# Altium schematic sheet MCU.SchDoc
size A4
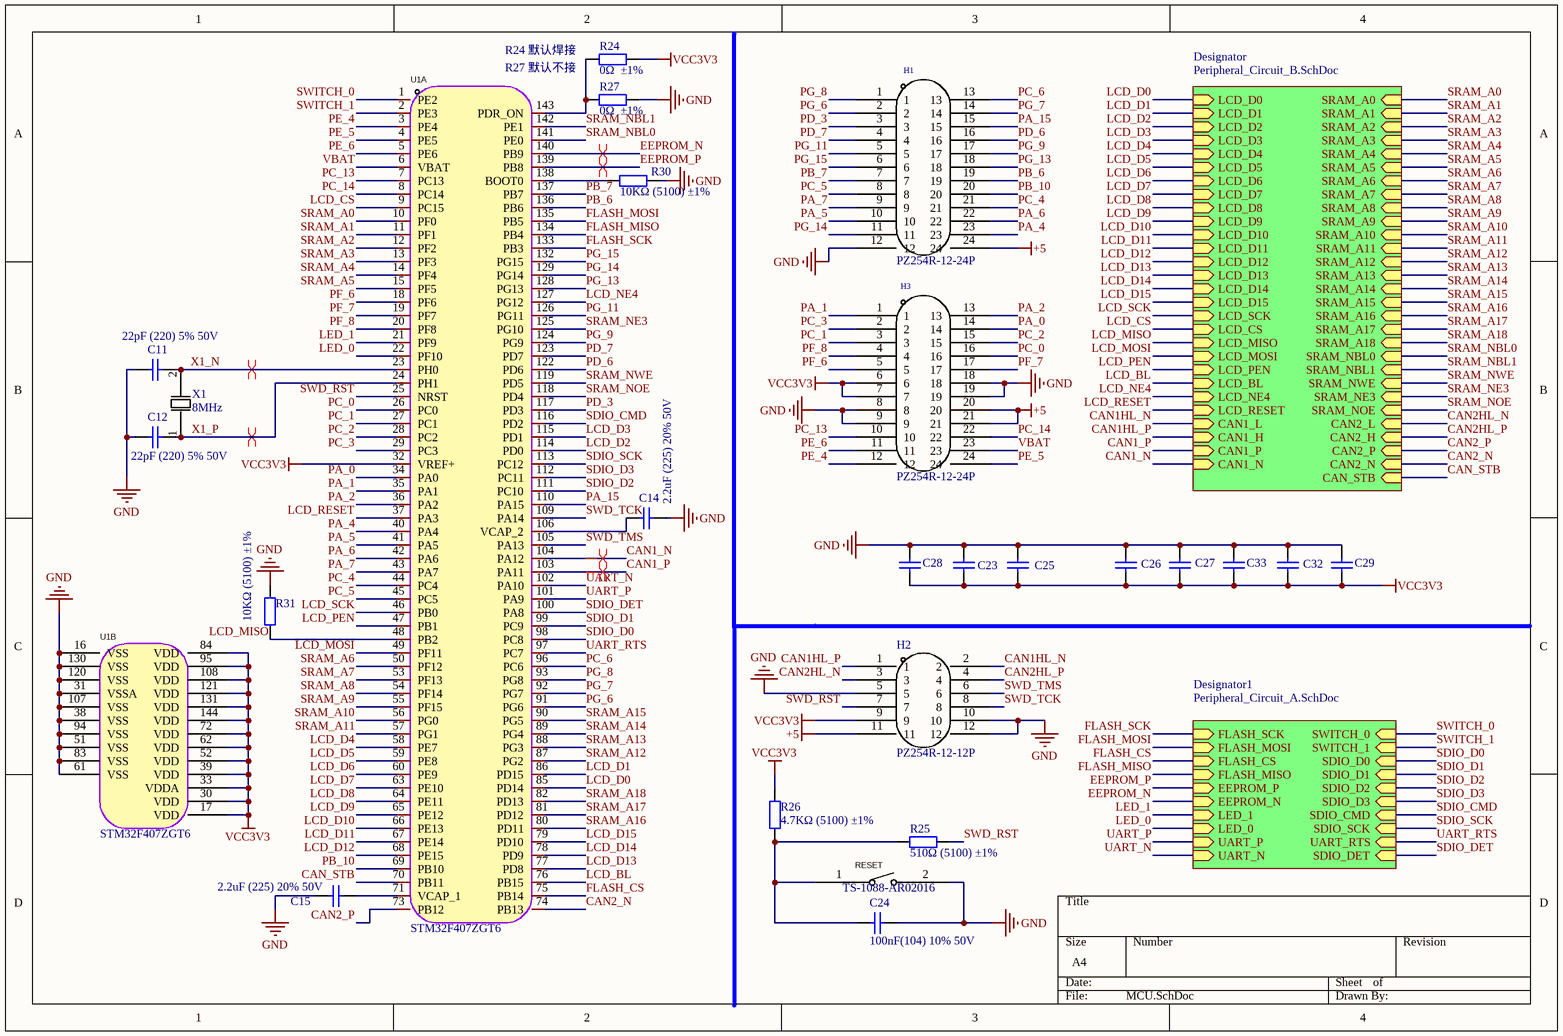
[diagram p0: MCU.SchDoc]

## Parts
C11  22pF (220) 5% 50V  [0805_C]
C12  22pF (220) 5% 50V  [0805_C]
C14  2.2uF (225) 20% 50V  [0805_C]
C15  2.2uF (225) 20% 50V  [0805_C]
C23  100nF(104) 10% 50V  [0805_C]  (value not drawn)
C24  100nF(104) 10% 50V  [0805_C]
C25  100nF(104) 10% 50V  [0805_C]  (value not drawn)
C26  100nF(104) 10% 50V  [0805_C]  (value not drawn)
C27  100nF(104) 10% 50V  [0805_C]  (value not drawn)
C28  100nF(104) 10% 50V  [0805_C]  (value not drawn)
C29  100nF(104) 10% 50V  [0805_C]  (value not drawn)
C32  100nF(104) 10% 50V  [0805_C]  (value not drawn)
C33  100nF(104) 10% 50V  [0805_C]  (value not drawn)
H1  PZ254R-12-24P  [PZ254R-12-24P]
H2  PZ254R-12-12P  [HDR-TH_12P-P2.54-H-M-R2-C6-S2.54]
H3  PZ254R-12-24P  [PZ254R-12-24P]
R24  0Ω  ±1%  [0805_R]
R25  510Ω (5100) ±1%  [0805_R]
R26  4.7KΩ (5100) ±1%  [0805_R]
R27  0Ω  ±1%  [0805_R]
R30  10KΩ (5100) ±1%  [0805_R]
R31  10KΩ (5100) ±1%  [0805_R]
RESET  TS-1088-AR02016  [SW-SMD_L3.9-W3.0-P4.45]
U1  STM32F407ZGT6  [LQFP-144_L20.0-W20.0-P0.50-LS22.0-BL]  (parts A,B of 2)
X1  8MHZ  [CRYSTAL-SMD_L5.0-W3.2]

## Sub-sheets
Designator = Peripheral_Circuit_B.SchDoc: LCD_D7 (in), LCD_D13 (in), LCD_D14 (in), LCD_D12 (in), LCD_D0 (in), LCD_SCK (in), LCD_D2 (in), LCD_D4 (in), LCD_D15 (in), LCD_NE4 (in), LCD_D3 (in), LCD_CS (in), LCD_D1 (in), LCD_RESET (in), LCD_MISO (in), LCD_MOSI (in), LCD_D10 (in), LCD_D8 (in), LCD_D6 (in), LCD_D5 (in), LCD_D9 (in), LCD_PEN (in), LCD_D11 (in), LCD_BL (in), SRAM_NWE (in), SRAM_NE3 (in), SRAM_NOE (in), SRAM_A12 (in), SRAM_A13 (in), SRAM_A16 (in), SRAM_A18 (in), SRAM_A10 (in), SRAM_A5 (in), SRAM_A17 (in), SRAM_A9 (in), SRAM_A7 (in), SRAM_A11 (in), SRAM_A15 (in), SRAM_A8 (in), SRAM_A6 (in), SRAM_A2 (in), SRAM_A14 (in), SRAM_NBL0 (in), SRAM_NBL1 (in), SRAM_A3 (in), SRAM_A0 (in), SRAM_A1 (in), SRAM_A4 (in), CAN2_L (in), CAN2_H (in), CAN2_P (in), CAN2_N (in), CAN1_N (in), CAN1_P (in), CAN1_H (in), CAN1_L (in), CAN_STB (in)
Designator1 = Peripheral_Circuit_A.SchDoc: LED_0 (in), SWITCH_1 (in), LED_1 (in), SWITCH_0 (in), SDIO_D0 (in), SDIO_SCK (in), FLASH_CS (in), SDIO_D2 (in), FLASH_SCK (in), SDIO_D3 (in), SDIO_D1 (in), SDIO_CMD (in), FLASH_MOSI (in), FLASH_MISO (in), SDIO_DET (in), EEPROM_P (in), EEPROM_N (in), UART_N (in), UART_P (in), UART_RTS (in)

## Nets
+5: H1.24 H2.11 H3.20 H3.21
GND: C11.1 C12.1 C14.2 C15.1 C23.2 C24.1 C25.2 C26.2 C27.2 C28.1 C29.1 C32.2 C33.1 H1.12 H2.5 H2.10 H2.12 H3.8 H3.9 H3.18 H3.19 R27.2 R30.1 R31.1 RESET.2 U1.16(VSS) U1.31(VSSA) U1.38(VSS) U1.51(VSS) U1.61(VSS) U1.83(VSS) U1.94(VSS) U1.107(VSS) U1.120(VSS) U1.130(VSS)
VCC3V3: C23.1 C25.1 C26.1 C27.1 C28.2 C29.2 C32.1 C33.2 H2.9 H3.6 H3.7 R24.2 R26.1 U1.17(VDD) U1.30(VDD) U1.32(VREF+) U1.33(VDDA) U1.39(VDD) U1.52(VDD) U1.62(VDD) U1.72(VDD) U1.84(VDD) U1.95(VDD) U1.108(VDD) U1.121(VDD) U1.131(VDD) U1.144(VDD)
CAN1_N: U1.104(PA12) ; sheet Designator/CAN1_N
CAN1_P: U1.103(PA11) ; sheet Designator/CAN1_P
CAN1HL_N: H2.2 ; sheet Designator/CAN1_L
CAN1HL_P: H2.1 ; sheet Designator/CAN1_H
CAN2_N: U1.74(PB13) ; sheet Designator/CAN2_N
CAN2_P: U1.73(PB12) ; sheet Designator/CAN2_P
CAN2HL_N: H2.3 ; sheet Designator/CAN2_L
CAN2HL_P: H2.4 ; sheet Designator/CAN2_H
CAN_STB: U1.70(PB11) ; sheet Designator/CAN_STB
EEPROM_N: U1.140(PB9) ; sheet Designator1/EEPROM_N
EEPROM_P: U1.139(PB8) ; sheet Designator1/EEPROM_P
FLASH_CS: U1.75(PB14) ; sheet Designator1/FLASH_CS
FLASH_MISO: U1.134(PB4) ; sheet Designator1/FLASH_MISO
FLASH_MOSI: U1.135(PB5) ; sheet Designator1/FLASH_MOSI
FLASH_SCK: U1.133(PB3) ; sheet Designator1/FLASH_SCK
LCD_BL: U1.76(PB15) ; sheet Designator/LCD_BL
LCD_CS: U1.9(PC15) ; sheet Designator/LCD_CS
LCD_D0: U1.85(PD14) ; sheet Designator/LCD_D0
LCD_D1: U1.86(PD15) ; sheet Designator/LCD_D1
LCD_D2: U1.114(PD0) ; sheet Designator/LCD_D2
LCD_D3: U1.115(PD1) ; sheet Designator/LCD_D3
LCD_D4: U1.58(PE7) ; sheet Designator/LCD_D4
LCD_D5: U1.59(PE8) ; sheet Designator/LCD_D5
LCD_D6: U1.60(PE9) ; sheet Designator/LCD_D6
LCD_D7: U1.63(PE10) ; sheet Designator/LCD_D7
LCD_D8: U1.64(PE11) ; sheet Designator/LCD_D8
LCD_D9: U1.65(PE12) ; sheet Designator/LCD_D9
LCD_D10: U1.66(PE13) ; sheet Designator/LCD_D10
LCD_D11: U1.67(PE14) ; sheet Designator/LCD_D11
LCD_D12: U1.68(PE15) ; sheet Designator/LCD_D12
LCD_D13: U1.77(PD8) ; sheet Designator/LCD_D13
LCD_D14: U1.78(PD9) ; sheet Designator/LCD_D14
LCD_D15: U1.79(PD10) ; sheet Designator/LCD_D15
LCD_MISO: R31.2 U1.48(PB2) ; sheet Designator/LCD_MISO
LCD_MOSI: U1.49(PF11) ; sheet Designator/LCD_MOSI
LCD_NE4: U1.127(PG12) ; sheet Designator/LCD_NE4
LCD_PEN: U1.47(PB1) ; sheet Designator/LCD_PEN
LCD_RESET: U1.37(PA3) ; sheet Designator/LCD_RESET
LCD_SCK: U1.46(PB0) ; sheet Designator/LCD_SCK
LED_0: U1.22(PF10) ; sheet Designator1/LED_0
LED_1: U1.21(PF9) ; sheet Designator1/LED_1
PA_0: H3.14 U1.34(PA0)
PA_1: H3.1 U1.35(PA1)
PA_2: H3.13 U1.36(PA2)
PA_4: H1.23 U1.40(PA4)
PA_5: H1.10 U1.41(PA5)
PA_6: H1.22 U1.42(PA6)
PA_7: H1.9 U1.43(PA7)
PA_15: H1.15 U1.110(PA15)
PB_6: H1.19 U1.136(PB6)
PB_7: H1.7 U1.137(PB7)
PB_10: H1.20 U1.69(PB10)
PC_0: H3.16 U1.26(PC0)
PC_1: H3.3 U1.27(PC1)
PC_2: H3.15 U1.28(PC2)
PC_3: H3.2 U1.29(PC3)
PC_4: H1.21 U1.44(PC4)
PC_5: H1.8 U1.45(PC5)
PC_6: H1.13 U1.96(PC6)
PC_13: H3.10 U1.7(PC13)
PC_14: H3.22 U1.8(PC14)
PD_3: H1.3 U1.117(PD3)
PD_6: H1.16 U1.122(PD6)
PD_7: H1.4 U1.123(PD7)
PE_4: H3.12 U1.3(PE4)
PE_5: H3.24 U1.4(PE5)
PE_6: H3.11 U1.5(PE6)
PF_6: H3.5 U1.18(PF6)
PF_7: H3.17 U1.19(PF7)
PF_8: H3.4 U1.20(PF8)
PG_6: H1.2 U1.91(PG6)
PG_7: H1.14 U1.92(PG7)
PG_8: H1.1 U1.93(PG8)
PG_9: H1.17 U1.124(PG9)
PG_11: H1.5 U1.126(PG11)
PG_13: H1.18 U1.128(PG13)
PG_14: H1.11 U1.129(PG14)
PG_15: H1.6 U1.132(PG15)
SDIO_CMD: U1.116(PD2) ; sheet Designator1/SDIO_CMD
SDIO_D0: U1.98(PC8) ; sheet Designator1/SDIO_D0
SDIO_D1: U1.99(PC9) ; sheet Designator1/SDIO_D1
SDIO_D2: U1.111(PC10) ; sheet Designator1/SDIO_D2
SDIO_D3: U1.112(PC11) ; sheet Designator1/SDIO_D3
SDIO_DET: U1.100(PA8) ; sheet Designator1/SDIO_DET
SDIO_SCK: U1.113(PC12) ; sheet Designator1/SDIO_SCK
SRAM_A0: U1.10(PF0) ; sheet Designator/SRAM_A0
SRAM_A1: U1.11(PF1) ; sheet Designator/SRAM_A1
SRAM_A2: U1.12(PF2) ; sheet Designator/SRAM_A2
SRAM_A3: U1.13(PF3) ; sheet Designator/SRAM_A3
SRAM_A4: U1.14(PF4) ; sheet Designator/SRAM_A4
SRAM_A5: U1.15(PF5) ; sheet Designator/SRAM_A5
SRAM_A6: U1.50(PF12) ; sheet Designator/SRAM_A6
SRAM_A7: U1.53(PF13) ; sheet Designator/SRAM_A7
SRAM_A8: U1.54(PF14) ; sheet Designator/SRAM_A8
SRAM_A9: U1.55(PF15) ; sheet Designator/SRAM_A9
SRAM_A10: U1.56(PG0) ; sheet Designator/SRAM_A10
SRAM_A11: U1.57(PG1) ; sheet Designator/SRAM_A11
SRAM_A12: U1.87(PG2) ; sheet Designator/SRAM_A12
SRAM_A13: U1.88(PG3) ; sheet Designator/SRAM_A13
SRAM_A14: U1.89(PG4) ; sheet Designator/SRAM_A14
SRAM_A15: U1.90(PG5) ; sheet Designator/SRAM_A15
SRAM_A16: U1.80(PD11) ; sheet Designator/SRAM_A16
SRAM_A17: U1.81(PD12) ; sheet Designator/SRAM_A17
SRAM_A18: U1.82(PD13) ; sheet Designator/SRAM_A18
SRAM_NBL0: U1.141(PE0) ; sheet Designator/SRAM_NBL0
SRAM_NBL1: U1.142(PE1) ; sheet Designator/SRAM_NBL1
SRAM_NE3: U1.125(PG10) ; sheet Designator/SRAM_NE3
SRAM_NOE: U1.118(PD4) ; sheet Designator/SRAM_NOE
SRAM_NWE: U1.119(PD5) ; sheet Designator/SRAM_NWE
SWD_RST: H2.7 R25.2 U1.25(NRST)
SWD_TCK: H2.8 U1.109(PA14)
SWD_TMS: H2.6 U1.105(PA13)
SWITCH_0: U1.1(PE2) ; sheet Designator1/SWITCH_0
SWITCH_1: U1.2(PE3) ; sheet Designator1/SWITCH_1
UART_N: U1.102(PA10) ; sheet Designator1/UART_N
UART_P: U1.101(PA9) ; sheet Designator1/UART_P
UART_RTS: U1.97(PC7) ; sheet Designator1/UART_RTS
VBAT: H3.23 U1.6(VBAT)
X1_N: C11.2 U1.23(PH0) X1.2
X1_P: C12.2 U1.24(PH1) X1.1
NetC14_1: C14.1 U1.106(VCAP_2)
NetC15_2: C15.2 U1.71(VCAP_1)
NetC24_2: C24.2 R25.1 R26.2 RESET.1
NetR24_1: R24.1 R27.1 U1.143(PDR_ON)
NetR30_2: R30.2 U1.138(BOOT0)

## Layout directives
differential pair: CAN1_N, CAN1_P, EEPROM_N, EEPROM_P, X1_N, X1_P

## Notes on the sheet
- R24 默认焊接
- (near U1) R27 默认不接

## Library data of the parts
C11 C12 = 0805 22pF (220) 5% 50V: 贴片电容; ComponentLink1Description: 供应商链接; ComponentLink1URL: http://www.szlcsc.com/product/details_2156.html; Package: 0805; Supplier: LC; SuppliersPartNumber: C1804
C14 C15 = 0805 2.2uF (225) 20% 50V: 贴片电容; ComponentLink1Description: 供应商链接; ComponentLink1URL: http://www.szlcsc.com/product/details_50225.html; Package: 0805; Supplier: LC; SuppliersPartNumber: C49217
C23-C29 C32 C33 = 0805 100nF(104) 10% 50V: 贴片电容; ComponentLink1Description: 供应商链接; ComponentLink1URL: http://www.szlcsc.com/product/details_50686.html; Package: 0805; Supplier: LC; SuppliersPartNumber: C49678
H1 H3 = PZ254R-12-24P: 2X12P 弯针; Manufacturer: XFCN(兴飞); Add into BOM: yes; Pitch: 2.54mm; Circluar Pins/Square Pins: 方针; Symbol: PZ254R-12-24P; Device: PZ254R-12-24P; Supplier: LCSC; Supplier Part: C492440; Manufacturer Part: PZ254R-12-24P; JLCPCB Part Class: 扩展库; LCSC Part Name: 间距:2.54mm 2x12P 弯插 方针; Supplier Footprint: 弯插,P=2.54mm; Datasheet: https://atta.szlcsc.com/upload/public/pdf/source/20200309/C492440_7713BEBBF73A70D81BA4F83CA4F38610.pdf; Convert to PCB: yes; Pin Structure: 2x12P; Row Spacing: 2.54mm; Mounting Type: 弯插; Number of Rows: 双排; Number of Pins: 24P; Current Rating (Max): -; Voltage Rating (Max): -; Length of Mating Pin: 6mm; Insulation Height: 2.5mm; Contact Material: 黄铜; Contact Plating: -; Operating Temperature Range: -40℃~+105℃; Color: 黑色; Name: PZ254R-12-24P
H2 = PZ254R-12-12P: 2X6P弯针; Manufacturer: XFCN(兴飞); Add into BOM: yes; Pin Structure: 2x6P; Pitch: 2.54mm; Circluar Pins/Square Pins: 方针; Symbol: PZ254R-12-12P; Device: PZ254R-12-12P; LCSC Part Name: 间距:2.54mm 2x6P 弯插 方针; Supplier Part: C492434; Manufacturer Part: PZ254R-12-12P; Supplier Footprint: 弯插,P=2.54mm; JLCPCB Part Class: 扩展库; Datasheet: https://atta.szlcsc.com/upload/public/pdf/source/20200309/C492434_8FF69D1295D71AC99A4B0B951ADD15B8.pdf; Supplier: LCSC; Convert to PCB: yes; Row Spacing: 2.54mm; Mounting Type: 弯插; Number of Rows: 双排; Number of Pins: 12P; Current Rating (Max): -; Voltage Rating (Max): -; Length of Mating Pin: 6mm; Insulation Height: 2.5mm; Contact Material: 黄铜; Contact Plating: -; Operating Temperature Range: -40℃~+105℃; Color: 黑色
R24-R27 R30 R31 = 0805 510Ω (5100) 1%: 贴片电阻; ComponentLink1Description: 供应商链接; ComponentLink1URL: http://www.szlcsc.com/product/details_18422.html; Package: 0805; Supplier: LC; SuppliersPartNumber: C17734
RESET = TS-1088-AR02016: 轻触开关; Manufacturer: XUNPU(讯普); Add into BOM: yes; Circuit: 单刀单掷; Actuator Style: 圆形按钮; Switch Length: 4mm; Switch Width: 3mm; Switch Height: 2mm; Strike Gundam: 不带; Contact Current: 50mA; Voltage Rating (DC): 12V; Insulation Resistance: 100MΩ; Actuator/Cap Color: 黑色; Operating Force: 160gf; Pin Style: SMD接片; Mechanical Life: 10万次; Symbol: TS-1088-AR02016; Device: TS-1088-AR02016; Supplier: LCSC; Supplier Part: C720477; Manufacturer Part: TS-1088-AR02016; JLCPCB Part Class: Extended Part; LCSC Part Name: 4*3*2mm 立贴 轻触开关; Supplier Footprint: SMD; Datasheet: https://atta.szlcsc.com/upload/public/pdf/source/20200810/C720475_60D09DD6C54279ADDB2DC25100F1CC11.pdf; Convert to PCB: yes; Mounting Style: 立贴; Operating Temperature: -30℃~+80℃
U1 = STM32F407ZGT6: STM32F407ZGT6MCU; Manufacturer: ST(意法半导体); Add into BOM: yes; CPU Core: ARM Cortex-M4; Maximum Frequency: 168MHz; Supply Voltage Range: 1.8V~3.6V; Internal Oscillator: 有; Program FLASH Size: 1MB; RAM Size: 192KB; GPIO Ports Number: 114; ADC (Units/Channels/bits): 1@x24ch/12bit; DAC (Units/Channels/bits): 1@x2ch/12bit; Peripherals / Functions / Protocol Stacks: 欠压检测/复位；DMA；LCD驱动；看门狗；POR；PWM; Name: STM32F407ZGT6; Symbol: STM32F407ZGT6; Device: STM32F407ZGT6; LCSC Part Name: ARM Cortex-M4 168MHz 闪存：1MB RAM：192KB; Supplier Part: C19156; Manufacturer Part: STM32F407ZGT6; Supplier Footprint: LQFP-144(20x20); JLCPCB Part Class: Extended Part; Datasheet: https://atta.szlcsc.com/upload/public/pdf/source/20140724/1457707162528.pdf; Supplier: LCSC; Convert to PCB: yes; EEPROM/Data FLASH Size: -; Operating Temperature Range: -40℃~+85℃
X1 = X50328MSB2GI: 贴片晶振; Manufacturer: YXC(扬兴晶振); Add into BOM: yes; Crystal Type: 贴片无源晶振; Load Capacitance: 20pF; Frequency Tolerance: ±10ppm; Frequency Stability: ±50ppm; Symbol: X50328MSB2GI; Device: X50328MSB2GI; Supplier: LCSC; Manufacturer Part: X50328MSB2GI; Value: 8MHz; Supplier Part: C115962; LCSC Part Name: 8MHz ±10ppm 20pF YSX530GA YSX530GA; Supplier Footprint: SMD5032-2P; Datasheet: https://atta.szlcsc.com/upload/public/pdf/source/20230220/0EBFFB9D6D8CE6A211407822BBB6C516.pdf; Convert to PCB: yes; Operating Temperature: -40℃~+85℃; Name: 8MHz